# EAGLE design ActuatorController (EAGLE 8.7.1)
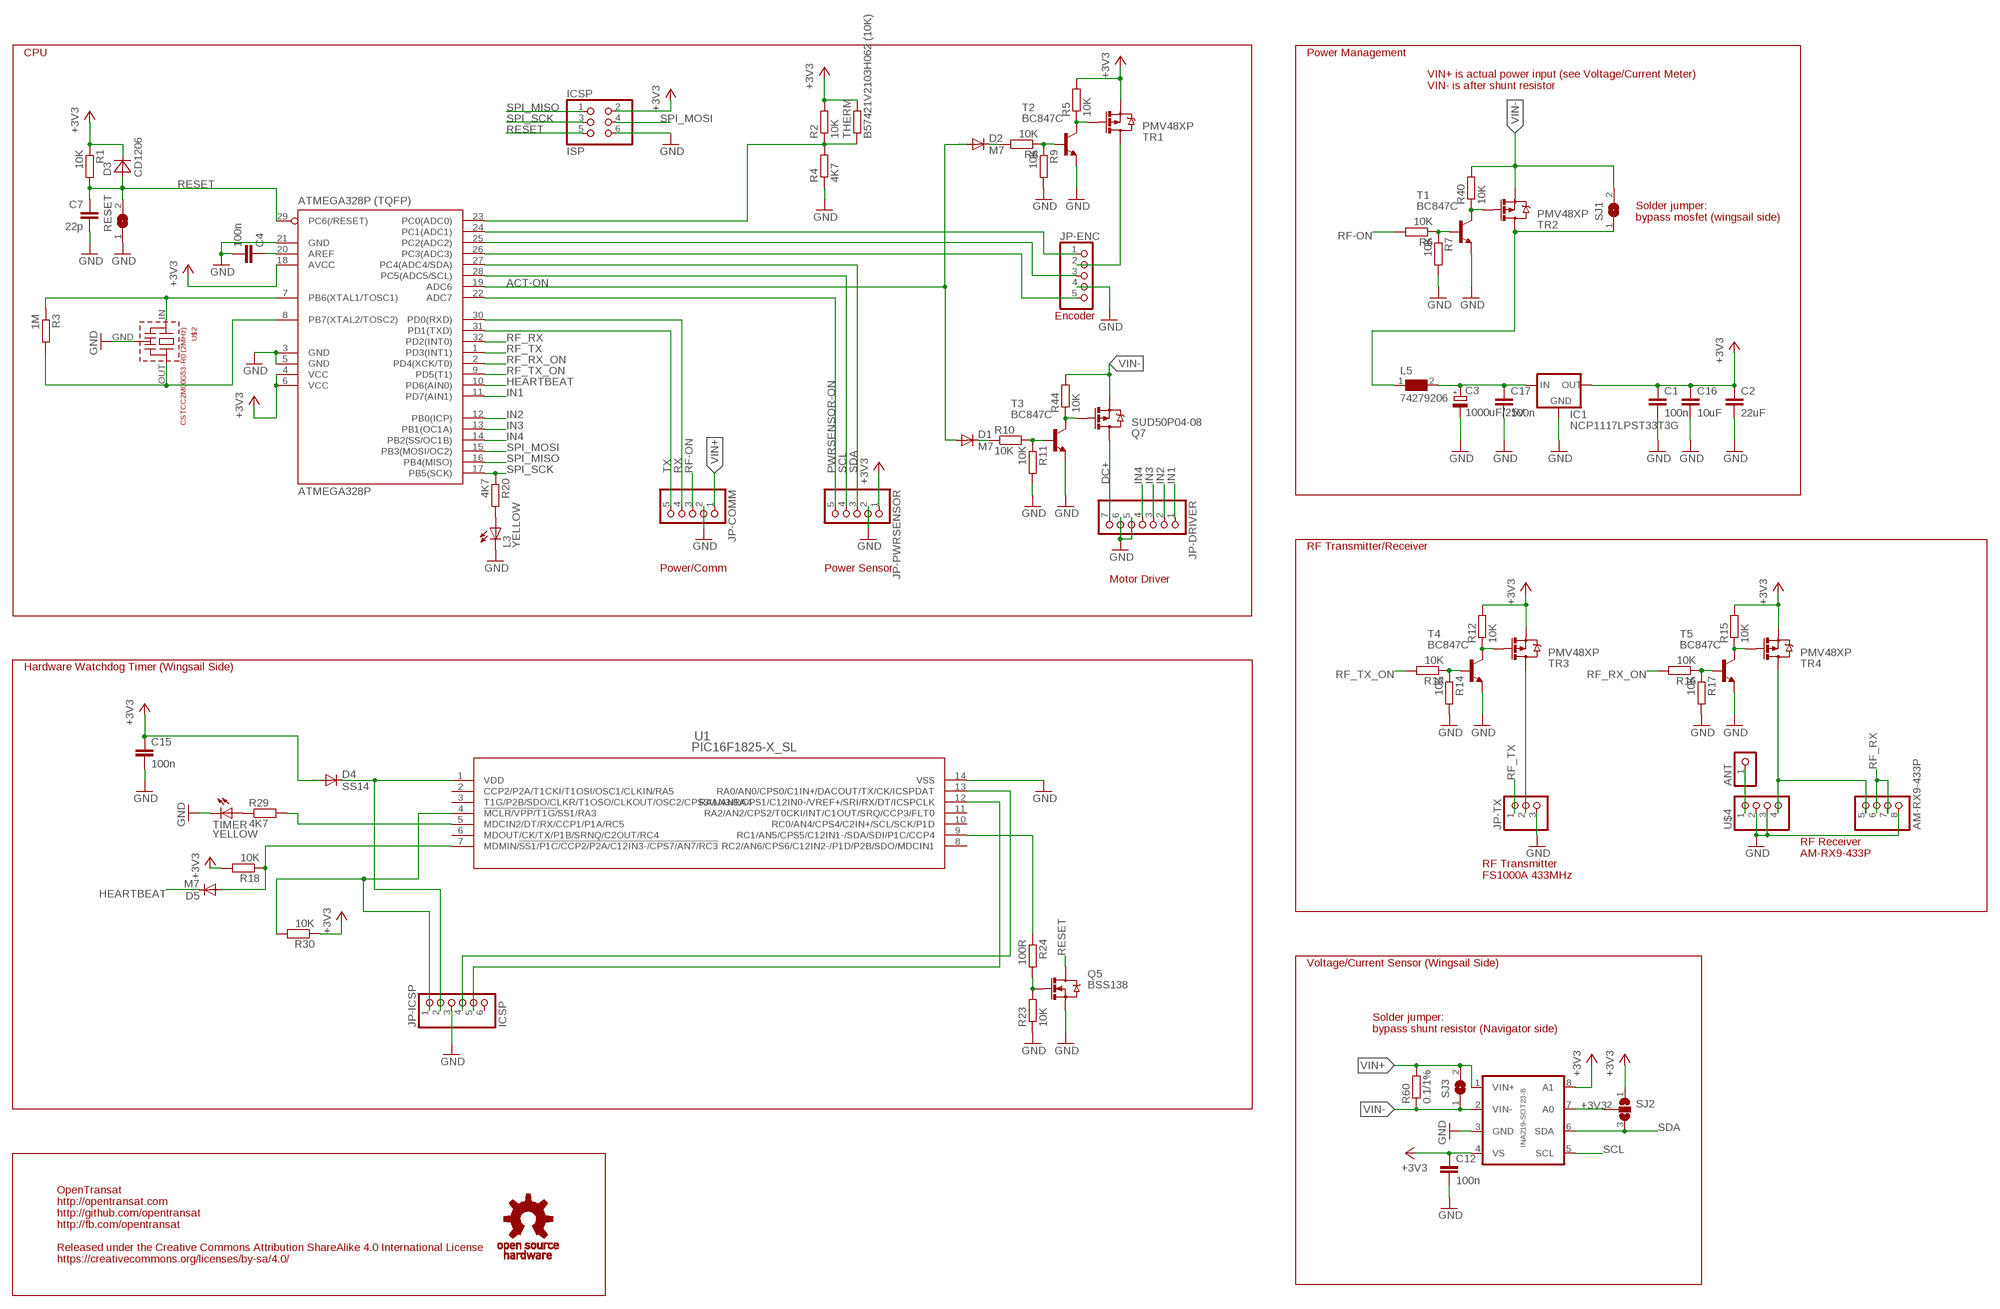
[diagram p0: schematic, sheet 1]

## Parts
ANT  PINHD-1X1  [1X01]
ATMEGA328P  ATMEGA328P (TQFP)  MEGA8-AI  [TQFP32-08]
C1  100n  C-EUC0603  [C0603]
C2  22uF  C-EUC1210  [C1210]
C3  1000uF/25V  CPOL-EUE5-10.5  [E5-10,5]
C4  100n  C-EUC0603  [C0603]
C7  22p  C-EUC0603  [C0603]
C12  100n  C-EUC0603  [C0603]
C15  100n  C-EUC0603  [C0603]
C16  10uF  C-EUC1206  [C1206]
C17  100n  C-EUC0603  [C0603]
D1  M7  DIODE-DO-214AC  [DO-214AC]
D2  M7  DIODE-DO-214AC  [DO-214AC]
D3  CD1206  [R1206]
D4  SS14  DIODE-DO214AC  [DO214AC]
D5  M7  DIODE-DO-214AC  [DO-214AC]
IC1  NCP1117LPST33T3G  LM1117MP-3.3  [SOT223]
ICSP  ISP  PINHD-2X3  [2X03]
JP-COMM  PINHD-1X5/90  [1X05/90]
JP-DRIVER  PINHD-1X7/90  [1X07/90]
JP-ENC  PINHD-1X5/90  [1X05/90]
JP-ICSP  ICSP  PINHD-1X6  [1X06]
JP-PWRSENSOR  PINHD-1X5/90  [1X05/90]
JP-TX  PINHD-1X3  [1X03]
L3  YELLOW  LEDCHIPLED_0805  [CHIPLED_0805]
L5  74279206  WE-CBF_0805  [0805]
Q5  BSS138  MOSFET-NCHANNEL_SOT23-3  [SOT23-3]
Q7  SUD50P04-08  MOSFET-PCHANNEL_D-PAK  [D-PAK_TO252AA]
R1  10K  R-EU_R0603  [R0603]
R2  10K  R-EU_R0603  [R0603]
R3  1M  R-EU_R0603  [R0603]
R4  4K7  R-EU_R0603  [R0603]
R5  10K  R-EU_R0603  [R0603]
R6  10K  R-EU_R0603  [R0603]
R7  10K  R-EU_R0603  [R0603]
R8  10K  R-EU_R0603  [R0603]
R9  10K  R-EU_R0603  [R0603]
R10  10K  R-EU_R0603  [R0603]
R11  10K  R-EU_R0603  [R0603]
R12  10K  R-EU_R0603  [R0603]
R13  10K  R-EU_R0603  [R0603]
R14  10K  R-EU_R0603  [R0603]
R15  10K  R-EU_R0603  [R0603]
R16  10K  R-EU_R0603  [R0603]
R17  10K  R-EU_R0603  [R0603]
R18  10K  R-EU_R0603  [R0603]
R20  4K7  R-EU_R0603  [R0603]
R23  10K  R-EU_R0603  [R0603]
R24  100R  R-EU_R0603  [R0603]
R29  4K7  R-EU_R0603  [R0603]
R30  10K  R-EU_R0603  [R0603]
R40  10K  R-EU_R0603  [R0603]
R44  10K  R-EU_R0603  [R0603]
R60  0.1/1%  R-EU_R2512  [R2512]
RESET  SJW  [SJW]
SJ1  SJ  [SJ]
SJ2  SJ2W  [SJ_2]
SJ3  SJ  [SJ]
T1  BC847C  BC847  [SOT23]
T2  BC847C  BC847  [SOT23]
T3  BC847C  BC847  [SOT23]
T4  BC847C  BC847  [SOT23]
T5  BC847C  BC847  [SOT23]
THERM  B57421V2103H062 (10K)  R-EU_R0603  [R0603]
TIMER  YELLOW  LEDCHIPLED_0805  [CHIPLED_0805]
TR1  PMV48XP  MOSFET-PCHANNEL_SOT23-3  [SOT23-3]
TR2  PMV48XP  MOSFET-PCHANNEL_SOT23-3  [SOT23-3]
TR3  PMV48XP  MOSFET-PCHANNEL_SOT23-3  [SOT23-3]
TR4  PMV48XP  MOSFET-PCHANNEL_SOT23-3  [SOT23-3]
U1  PIC16F1825-X_SL  [SOIC14-N_MC]
U$1  OSHW_S  [OSHWS]
U$2  CSTCC2M00G53-R0 (2MHz)  CSTCC  [CSTCC]
U$3  INA219-SOT23-8  [SOT23-8]
U$4  AM-RX9-433P  [1X04]

## Nets
+3V3: ATMEGA328P.4(VCC) ATMEGA328P.6(VCC) ATMEGA328P.18(AVCC) C1.1 C2.1 C12.1 C15.1 C16.1 D3.2(C) D4.A IC1.2(OUT) IC1.4(OUT) ICSP.2 JP-PWRSENSOR.1 R1.1 R2.2 R5.2 R12.2 R15.2 R18.2 R30.1 SJ2.1 SJ2.2 THERM.2 TR1.2(S) TR3.2(S) TR4.2(S) U$3.4(VS) U$3.7(A0) U$3.8(A1)
ACT-ON: ATMEGA328P.19(ADC6) D1.A D2.A
AREF: ATMEGA328P.20(AREF) C4.1
DC+ [1A]: JP-DRIVER.7 Q7.2(D)
GND [1A]: ATMEGA328P.3(GND) ATMEGA328P.5(GND) ATMEGA328P.21(GND) C1.2 C2.2 C3.- C4.2 C7.2 C12.2 C15.2 C16.2 C17.2 IC1.1(GND) ICSP.6 JP-COMM.2 JP-DRIVER.5 JP-DRIVER.6 JP-ENC.4 JP-ICSP.3 JP-PWRSENSOR.2 JP-TX.3 L3.C Q5.2(S) R4.1 R7.2 R9.2 R11.2 R14.2 R17.2 R23.1 RESET.1 T1.2(E) T2.2(E) T3.2(E) T4.2(E) T5.2(E) TIMER.C U1.14(VSS) U$2.GND U$3.3(GND) U$4.2 U$4.3 U$4.8
HEARTBEAT: ATMEGA328P.10(PD6(AIN0)) D5.C
IN1: ATMEGA328P.11(PD7(AIN1)) JP-DRIVER.1
IN2: ATMEGA328P.12(PB0(ICP)) JP-DRIVER.2
IN3: ATMEGA328P.13(PB1(OC1A)) JP-DRIVER.3
IN4: ATMEGA328P.14(PB2(SS/OC1B)) JP-DRIVER.4
N$1: C3.+ C17.1 IC1.3(IN) L5.2
N$3: R5.1 T2.3(C) TR1.1(G)
N$4: L3.A R20.2
N$5: R10.2 R11.1 T3.1(B)
N$6: ATMEGA328P.23(PC0(ADC0)) R2.1 R4.2 THERM.1
N$7: ATMEGA328P.24(PC1(ADC1)) JP-ENC.1
N$8: ATMEGA328P.25(PC2(ADC2)) JP-ENC.3
N$9: ATMEGA328P.26(PC3(ADC3)) JP-ENC.5
N$11: R8.1 R9.1 T2.1(B)
N$12: R6.1 R7.1 T1.1(B)
N$13: JP-ENC.2 TR1.3(D)
N$14: D2.C R8.2
N$15: D1.C R10.1
N$17: R12.1 T4.3(C) TR3.1(G)
N$19: R13.1 R14.1 T4.1(B)
N$20: ANT.1 U$4.1
N$21: JP-TX.2 TR3.3(D)
N$23: R15.1 T5.3(C) TR4.1(G)
N$24: R16.1 R17.1 T5.1(B)
N$25: TR4.3(D) U$4.4 U$4.5
N$26: D5.A R18.1 U1.7(MDMIN/!SS1/P1C/CCP2/P2A/C12IN3-/CPS7/AN7/RC3)
N$30: JP-ICSP.4 U1.13(RA0/AN0/CPS0/C1IN+/DACOUT/TX/CK/ICSPDAT)
N$32: Q7.1(G) R44.1 T3.3(C)
N$35: R40.1 T1.3(C) TR2.1(G)
N$36: JP-ICSP.1 R30.2 U1.4(!MCLR/VPP/T1G/!SS1/RA3)
N$37: JP-ICSP.5 U1.12(RA1/AN1/CPS1/C12IN0-/VREF+/SRI/RX/DT/ICSPCLK)
N$41: D4.C JP-ICSP.2 U1.1(VDD)
N$42: R24.1 U1.9(RC1/AN5/CPS5/C12IN1-/SDA/SDI/P1C/CCP4)
N$46: Q5.1(G) R23.2 R24.2
N$51: R29.2 U1.5(MDCIN2/DT/RX/CCP1/P1A/RC5)
N$52: R29.1 TIMER.A
PWRSENSOR-ON: ATMEGA328P.22(ADC7) JP-PWRSENSOR.5
RESET: ATMEGA328P.29(PC6(/RESET)) C7.1 D3.1(A) ICSP.5 Q5.3(D) R1.2 RESET.2
RF-ON: JP-COMM.3 R6.2
RF_RX: ATMEGA328P.32(PD2(INT0)) U$4.6 U$4.7
RF_RX_ON: ATMEGA328P.2(PD4(XCK/T0)) R16.2
RF_TX: ATMEGA328P.1(PD3(INT1)) JP-TX.1
RF_TX_ON: ATMEGA328P.9(PD5(T1)) R13.2
RX: ATMEGA328P.30(PD0(RXD)) JP-COMM.4
SCL: ATMEGA328P.28(PC5(ADC5/SCL)) JP-PWRSENSOR.4 U$3.5(SCL)
SDA: ATMEGA328P.27(PC4(ADC4/SDA)) JP-PWRSENSOR.3 SJ2.3 U$3.6(SDA)
SPI_MISO: ATMEGA328P.16(PB4(MISO)) ICSP.1
SPI_MOSI: ATMEGA328P.15(PB3(MOSI/OC2)) ICSP.4
SPI_SCK: ATMEGA328P.17(PB5(SCK)) ICSP.3 R20.1
TX: ATMEGA328P.31(PD1(TXD)) JP-COMM.5
VBAT-ON: L5.1 SJ1.1 TR2.3(D)
VIN+ [1A]: JP-COMM.1 R60.2 SJ3.2 U$3.1(VIN+)
VIN- [1A]: Q7.3(S) R40.2 R44.2 R60.1 SJ1.2 SJ3.1 TR2.2(S) U$3.2(VIN-)
XTAL1: ATMEGA328P.8(PB7(XTAL2/TOSC2)) R3.2 U$2.OUT
XTAL2: ATMEGA328P.7(PB6(XTAL1/TOSC1)) R3.1 U$2.IN
Unconnected: JP-ICSP.6 U1.2(CCP2/P2A/T1CKI/T1OSI/OSC1/CLKIN/RA5) U1.3(T1G/P2B/SDO/CLKR/T1OSO/CLKOUT/OSC2/CPS3/AN3/RA4) U1.6(MDOUT/CK/TX/P1B/SRNQ/C2OUT/RC4) U1.8(RC2/AN6/CPS6/C12IN2-/P1D/P2B/SDO/MDCIN1) U1.10(RC0/AN4/CPS4/C2IN+/SCL/SCK/P1D) U1.11(RA2/AN2/CPS2/T0CKI/INT/C1OUT/SRQ/CCP3/FLT0)

## Notes on the sheet
- CPU | Power Management
- VIN+ is actual power input (see Voltage/Current Meter)
  VIN- is after shunt resistor
- Solder jumper:
  bypass mosfet (wingsail side)
- Encoder
- RF Transmitter/Receiver
- Power/Comm | Power Sensor
- Motor Driver
- Hardware Watchdog Timer (Wingsail Side)
- RF Receiver
  AM-RX9-433P
- RF Transmitter
  FS1000A 433MHz
- Voltage/Current Sensor (Wingsail Side)
- Solder jumper:
  bypass shunt resistor (Navigator side)
- OpenTransat
  http://opentransat.com
  http://github.com/opentransat
  http://fb.com/opentransat
  
  Released under the Creative Commons Attribution ShareAlike 4.0 International License
  https://creativecommons.org/licenses/by-sa/4.0/

## Library data of the parts
ANT = pinhead:PINHD-1X1: PIN HEADER
ATMEGA328P = atmel:MEGA8: MICROCONTROLLER 8 Kbytes FLASH, 1 kbytes SRAM, 512 bytes EEPROM, USART, 6-channel 10 bit ADC, 2-channel 8 bit ADC Pin compatible with Atmega48, ATMega88, ATMega168 Source: avr.lbr; MPN: ATMEGA8-16AU; OC_FARNELL: 9171371; OC_NEWARK: 73M8863
C1 C2 C4 C7 C12 C15-C17 = rcl:C-EU: CAPACITOR, European symbol; SPICEPREFIX: C
C3 = transducer:CPOL-EU: POLARIZED CAPACITOR, European symbol
D1 D2 D4 D5 = diode:DIODE-: DIODE
D3 = diodes_smd:CD1206
IC1 = lm1117_10:LM1117?-*: 800mA Low-Dropout Linear Regulator Source: http://www.ti.com/lit/ds/symlink/lm1117-n.pdf; MF: Texas Instruments; MPN: LM1117MP-3.3; OC_FARNELL: 9778195; OC_NEWARK: 28X3416
ICSP = pinhead:PINHD-2X3: PIN HEADER
JP-COMM JP-ENC JP-PWRSENSOR = pinhead:PINHD-1X5: PIN HEADER
JP-DRIVER = pinhead:PINHD-1X7: PIN HEADER
JP-ICSP = pinhead:PINHD-1X6: PIN HEADER
JP-TX = pinhead:PINHD-1X3: PIN HEADER
L3 TIMER = led:LED: LED OSRAM: - CHIPLED LG R971, LG N971, LY N971, LG Q971, LY Q971, LO R971, LY R971 LH N974, LH R974 LS Q976, LO Q976, LY Q976 LO Q996 - Hyper CHIPLED LW Q18S LB Q993, LB Q99A, LB R99A - SideLED LS A670, LO A670, LY A670, LG A670, LP A670 LB A673, LV A673, LT A673, LW A673 LH A674 LY A675 LS A676, LA A676, LO A676, LY A676, LW A676 LS A679, LY A679, LG A679 - Hyper Micro SIDELED® LS Y876, LA Y876, LO Y876, LY Y876 LT Y87S - SmartLED LW L88C, LW L88S LB L89C, LB L89S, LG L890 LS L89K, LO L89K, LY L89K LS L896, LA L896, LO L896, LY L896 - TOPLED LS T670, LO T670, LY T670, LG T670, LP T670 LSG T670, LSP T670, LSY T670, LOP T670, LYG T670 LG T671, LOG T671, LSG T671 LB T673, LV T673, LT T673, LW T673 LH T674 LS T676, LA T676, LO T676, LY T676, LB T676, LH T676, LSB T676, LW T676 LB T67C, LV T67C, LT T67C, LS T67K, LO T67K, LY T67K, LW E67C LS E67B, LA E67B, LO E67B, LY E67B, LB E67C, LV E67C, LT E67C LW T67C LS T679, LY T679, LG T679 LS T770, LO T770, LY T770, LG T770, LP T770 LB T773, LV T773, LT T773, LW T773 LH T774 LS E675, LA E675, LY E675, LS T675 LS T776, LA T776, LO T776, LY T776, LB T776 LHGB T686 LT T68C, LB T68C - Hyper Mini TOPLED® LB M676 - Mini TOPLED Santana® LG M470 LS M47K, LO M47K, LY M47K Source: http://www.osram.convergy.de LUXEON: - LUMILED® LXK2-PW12-R00, LXK2-PW12-S00, LXK2-PW14-U00, LXK2-PW14-V00 LXK2-PM12-R00, LXK2-PM12-S00, LXK2-PM14-U00 LXK2-PE12-Q00, LXK2-PE12-R00, LXK2-PE12-S00, LXK2-PE14-T00, LXK2-PE14-U00 LXK2-PB12-K00, LXK2-PB12-L00, LXK2-PB12-M00, LXK2-PB14-N00, LXK2-PB14-P00, LXK2-PB14-Q00 LXK2-PR12-L00, LXK2-PR12-M00, LXK2-PR14-Q00, LXK2-PR14-R00 LXK2-PD12-Q00, LXK2-PD12-R00, LXK2-PD12-S00 LXK2-PH12-R00, LXK2-PH12-S00 LXK2-PL12-P00, LXK2-PL12-Q00, LXK2-PL12-R00 Source: www.luxeon.com KINGBRIGHT: KA-3528ASYC Source: www.kingbright.com
L5 = Wurth_Elektronik_Passive_rev15b:WE-CBF: SMD EMI Suppression Ferrite Beads WE-CBF - Excellent anti-EMI properties - Low DC-restistance - Impedances till 3000 ohms - Rated current up to 6 A -- Reliable Ni-Sn electrodes -- Perfect as data lined filter and for uncoupling of distribution voltage <http://katalog.we-online.de/media/images/eisos/FeCBF_pf2.jpg> Details see: http://katalog.we-online.de/en/pbs/WE-CBF updated by Dan Xu 2014-06-19 2014 (C) Würth Elektronik
Q5 = Simplex-DiscreteSemi:MOSFET-NCHANNEL: Generic N-channel mosfet
Q7 TR1-TR4 = Simplex-DiscreteSemi:MOSFET-PCHANNEL: Generic P-channel mosfet
R1-R18 R20 R23 R24 R29 R30 R40 R44 R60 THERM = rcl:R-EU_: RESISTOR, European symbol; SPICEPREFIX: R
RESET SJ1 SJ3 = jumper:SJ: SMD solder JUMPER
SJ2 = jumper:SJ2W: SMD solder JUMPER
T1-T5 = transistor:BC847: NPN TRANSISTOR
U1 = PIC16F1825:PIC16F1825-X_SL
U$1 = oshw:OSHW_S
U$2 = murata-cstcc-cstcv-resonators:CSTCC: Murata CSTCC Resonator - 7,2 x 3,0 mm
U$3 = INA219:INA219-SOT23-8: INA219 Bi-Directional CURRENT/POWER MONITOR with I2C™ Interface http://www.ti.com/lit/ds/symlink/ina219.pdf
U$4 = AM-RX9:AM-RX9-433P

## Net classes
4 1A: width 0.305 mm, drill 0.305 mm, clearance 0.305 mm

## Board
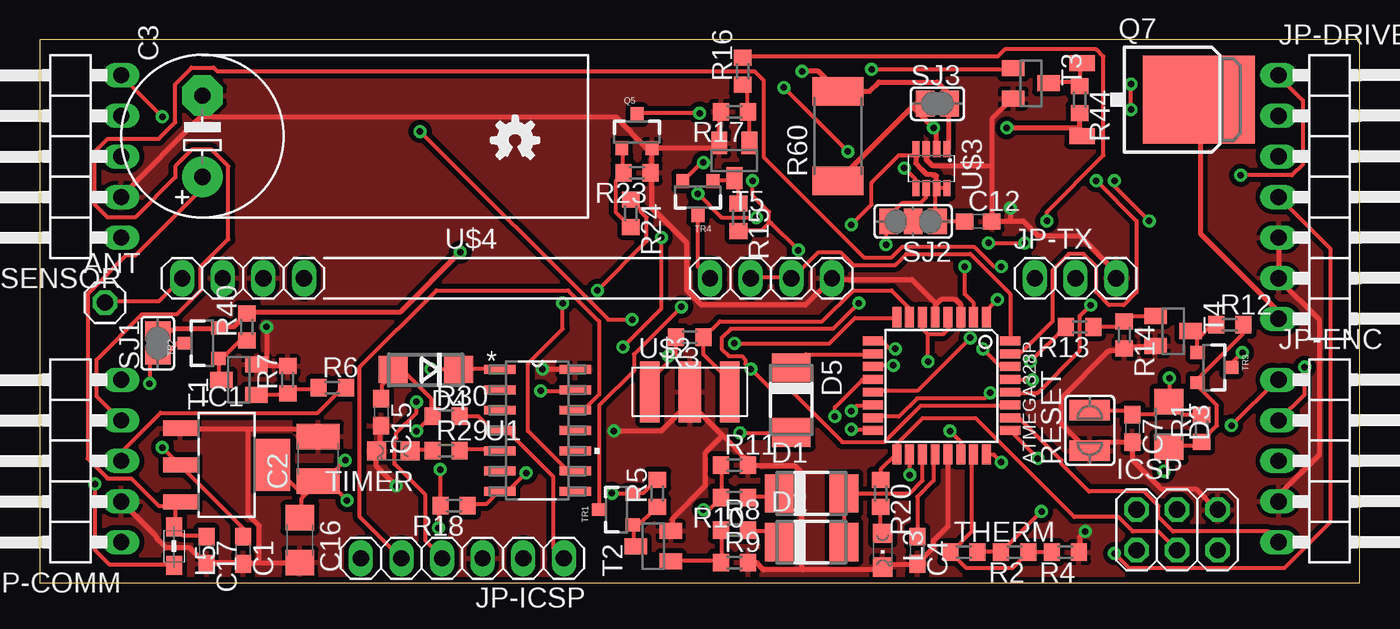
[diagram p1: board, top side]
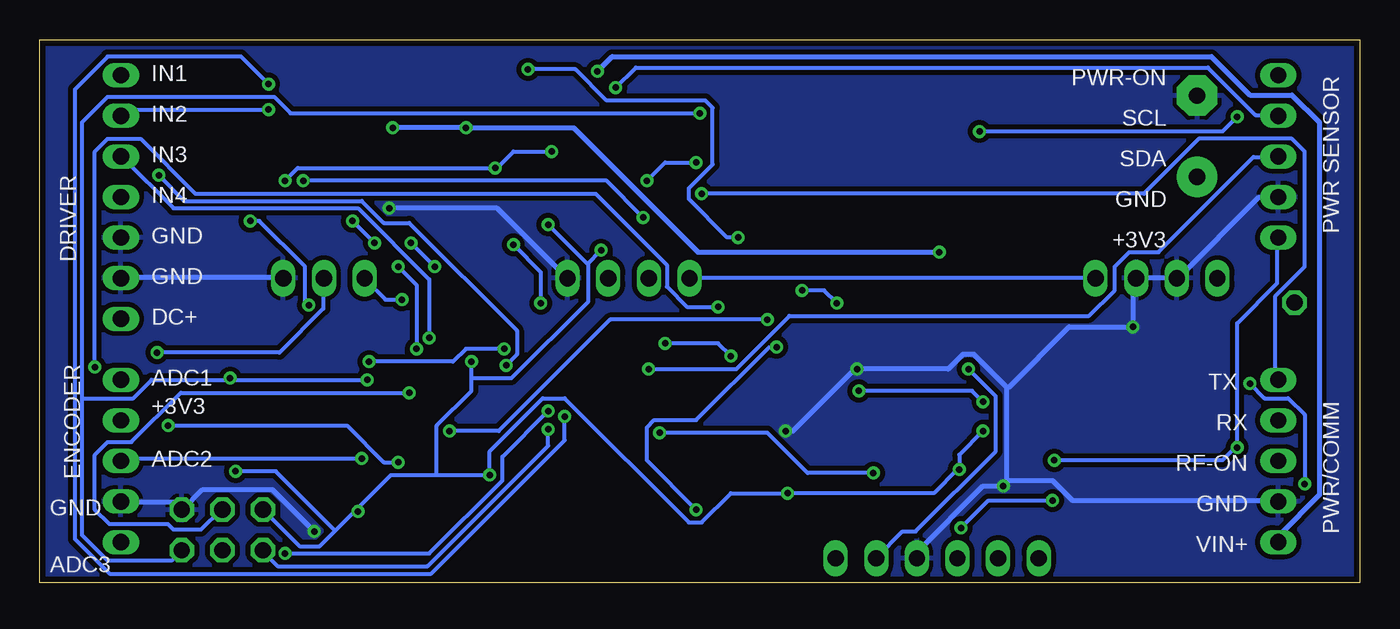
[diagram p2: board, bottom side, seen from below]

Size 82.53 x 33.96 mm. Coordinates in mm from the lower left corner, seen from the top.
Outline: 0,0 82.53,0 82.53,33.96 0,33.96 0,0
Copper layers (1*16): Top 0.035mm / dielectric 1.5mm / Bottom 0.035mm
Design rules "autorouter": minimum track width 10mil, minimum drill 16mil, track to track 8mil, track to pad 8mil, pad to pad 8mil, via to via 8mil, smd to smd 8mil, copper to edge 15mil, drill to drill 12mil, minimum pad ring 10mil, minimum via ring 8mil, stop-mask expansion 1mil, vias tented up to drill 30mil, thermal gap 10mil

### Footprints (pad centres in the part's own frame; a part is rotated, then mirrored left to right if it is on the bottom)
1X01 = drill 1.016 octagon: 1 0,0
TQFP32-08 = smd 1.27 x 0.559: 1 -4.293,2.8; 2 -4.293,2; 3 -4.293,1.2; 4 -4.293,0.4; 5 -4.293,-0.4; 6 -4.293,-1.2; 7 -4.293,-2; 8 -4.293,-2.8; 17 4.293,-2.8; 18 4.293,-2; 19 4.293,-1.2; 20 4.293,-0.4; 21 4.293,0.4; 22 4.293,1.2; 23 4.293,2; 24 4.293,2.8 | smd 0.559 x 1.27: 9 -2.8,-4.293; 10 -2,-4.293; 11 -1.2,-4.293; 12 -0.4,-4.293; 13 0.4,-4.293; 14 1.2,-4.293; 15 2,-4.293; 16 2.8,-4.293; 25 2.8,4.293; 26 2,4.293; 27 1.2,4.293; 28 0.4,4.293; 29 -0.4,4.293; 30 -1.2,4.293; 31 -2,4.293; 32 -2.8,4.293
C0603 = smd 1.1 x 1: 1 -0.85,0; 2 0.85,0
C1210 = smd 1.6 x 2.7: 1 -1.4,0; 2 1.4,0
E5-10,5 = drill 1.016 pad 2.54: + -2.54,0 | drill 1.016 pad 2.54 octagon: - 2.54,0
C1206 = smd 1.6 x 1.8: 1 -1.4,0; 2 1.4,0
DO-214AC = smd 1.8 x 2.4: A 2.025,0; C -2.025,0
R1206 = smd 1.6 x 1.803: 1 -1.422,0; 2 1.422,0
DO214AC = smd 1.8 x 1.7: A 2.05,0; C -2.05,0
SOT223 = smd 0.95 x 2.15: 1 -2.3,-2.9; 2 0,-2.9; 3 2.3,-2.9 | smd 3.25 x 2.15: 4 0,2.9
2X03 = drill 1.016 octagon: 1 -2.54,-1.27; 2 -2.54,1.27; 3 0,-1.27; 4 0,1.27; 5 2.54,-1.27; 6 2.54,1.27
1X05/90 = drill 1.016 long: 1 -5.08,-3.81; 2 -2.54,-3.81; 3 0,-3.81; 4 2.54,-3.81; 5 5.08,-3.81
1X07/90 = drill 1.016 long: 1 -7.62,-3.81; 2 -5.08,-3.81; 3 -2.54,-3.81; 4 0,-3.81; 5 2.54,-3.81; 6 5.08,-3.81; 7 7.62,-3.81
1X06 = drill 1.016 long: 1 -6.35,0; 2 -3.81,0; 3 -1.27,0; 4 1.27,0; 5 3.81,0; 6 6.35,0
1X03 = drill 1.016 long: 1 -2.54,0; 2 0,0; 3 2.54,0
CHIPLED_0805 = smd 1.2 x 1.2: A 0,-1.05; C 0,1.05
0805 = smd 1.2 x 1: 1 -1.2,0; 2 1.2,0
SOT23-3 = smd 0.8 x 0.9: 1 -0.95,-1; 2 0.95,-1; 3 0,1.1
D-PAK_TO252AA = smd 1 x 1.6: 1 -2.28,-4.8; 3 2.28,-4.8 | smd 5.5 x 7: 2 0,2.5
R0603 = smd 1 x 1.1: 1 -0.85,0; 2 0.85,0
R2512 = smd 1.8 x 3.2: 1 -2.8,0; 2 2.8,0
SJW = smd 1.27 x 2.54: 1 -1.27,0; 2 1.27,0
SJ = smd 1.168 x 1.6: 1 -0.762,0; 2 0.762,0
SJ_2 = smd 1.168 x 1.6: 1 -1.524,0; 2 0,0; 3 1.524,0
SOT23 = smd 1 x 1.4: 1 -0.95,-1.1; 2 0.95,-1.1; 3 0,1.1
SOIC14-N_MC = smd 1.981 x 0.559: 1 -2.362,3.81; 2 -2.362,2.54; 3 -2.362,1.27; 4 -2.362,0; 5 -2.362,-1.27; 6 -2.362,-2.54; 7 -2.362,-3.81; 8 2.362,-3.81; 9 2.362,-2.54; 10 2.362,-1.27; 11 2.362,0; 12 2.362,1.27; 13 2.362,2.54; 14 2.362,3.81
CSTCC = smd 1.4 x 3.8: GND 0,0 | smd 1.2 x 3.8: IN 2.5,0; OUT -2.5,0
SOT23-8 = smd 1 x 0.45: 1 -1.225,0.975; 2 -1.225,0.325; 3 -1.225,-0.325; 4 -1.225,-0.975; 5 1.225,-0.975; 6 1.225,-0.325; 7 1.225,0.325; 8 1.225,0.975
1X04 = drill 1.016 long: 1 -3.81,0; 2 -1.27,0; 3 1.27,0; 4 3.81,0; 5 29.21,0; 6 31.75,0; 7 34.29,0; 8 36.83,0

### Placement (x,y rotation side)
ANT  4.06,17.53 0 top
ATMEGA328P  56.39,12.32 270 top
C1  12.7,2.03 270 top
C2  17.4,7.75 90 top
C3  10.16,27.94 90 top
C4  54.86,2.03 270 top
C7  68.33,9.65 270 top
C12  58.67,22.61 0 top
C15  21.34,10.67 270 top
C16  16.26,2.67 270 top
C17  10.41,2.03 270 top
D1  48.26,5.59 0 top
D2  48.26,2.54 0 top
D3  70.61,9.91 270 top
D4  24.13,13.34 180 top
D5  46.99,11.43 270 top
IC1  11.68,7.37 270 top
ICSP  71.12,3.3 0 top
JP-COMM  1.27,7.62 90 top
JP-DRIVER  81.28,24.13 270 top
JP-ENC  81.28,7.62 270 top
JP-ICSP  26.42,1.52 180 top
JP-PWRSENSOR  1.27,26.67 90 top
JP-TX  64.77,19.05 0 top
L3  52.7,2.03 180 top
L5  8.38,2.29 90 top
Q5  37.34,28.19 0 top
Q7  69.98,30.23 270 top
R1  72.64,9.65 90 top
R2  60.96,1.91 180 top
R3  40.64,15.37 180 top
R4  64.14,1.91 180 top
R5  38.61,5.59 90 top
R6  18.29,12.19 0 top
R7  15.49,12.7 90 top
R8  43.43,3.3 0 top
R9  43.43,1.27 0 top
R10  43.43,5.33 180 top
R11  43.43,7.37 0 top
R12  74.42,16.13 0 top
R13  65.02,16 180 top
R14  67.82,15.49 270 top
R15  43.69,22.86 270 top
R16  43.94,32 90 top
R17  43.43,29.46 180 top
R18  25.91,4.83 180 top
R20  52.58,5.59 270 top
R23  37.34,25.65 180 top
R24  36.96,23.11 270 top
R29  25.4,8.26 0 top
R30  25.4,10.41 0 top
R40  12.95,16 90 top
R44  65.02,30.23 270 top
R60  49.91,27.94 90 top
RESET  65.66,9.53 90 top
SJ1  7.37,14.99 90 top
SJ2  54.61,22.61 180 top
SJ3  56.13,29.97 0 top
T1  12.45,12.7 90 top
T2  38.35,2.29 90 top
T3  61.98,31.24 270 top
T4  70.87,15.75 270 top
T5  43.43,26.42 180 top
THERM  57.78,1.91 0 top
TIMER  22.1,8.26 90 top
TR1  36.07,4.57 90 top
TR2  10.16,14.99 90 top
TR3  73.41,13.46 270 top
TR4  41.15,24.13 180 top
U1  31.11,9.53 0 top
U$1  29.72,27.69 0 top
U$2  40.64,11.94 0 top
U$3  55.75,25.91 270 top
U$4  12.7,19.05 0 top

### Tracks (layer width: path | path; a pad name or v marks a point on that pad's centre or on a via)
+3V3  (via drill 0.41)
  Top 0.254: 16.52,5.43 17.37,6.29 C2.1 | 16.52,5.43 16.34,5.26 16.34,4.12 C16.1 | 16.52,5.43 14.63,7.32 IC1.4 | C1.1 12.69,2.97 12.69,3.43 8.8,7.32 IC1.2 8.69,7.43 v7.66,8.46 | v19.09,7.66 17.83,6.4 17.49,6.4 C2.1 | R5.2 38.52,6.4 37.72,5.6 37.15,5.6 TR1.2 37.03,5.6 v35.78,5.6 | v25.03,7.09 25.03,4.92 R18.2 24.92,4.92 v24.92,3.43 | v23.55,9.49 24.46,10.4 R30.1 24.46,10.52 24.46,11.54 22.75,13.26 22.17,13.26 D4.A 22.17,13.14 21.37,12.34 21.37,11.54 C15.1 | R12.2 75.21,16.12 75.21,15.54 72.47,12.8 72.47,12.57 TR3.2 72.47,12.46 72.47,12.23 73.61,11.09 73.61,9.83 72.69,8.91 R1.1 72.58,8.8 72.35,8.57 70.64,8.57 D3.2 70.52,8.46 70.52,7.2 v70.29,6.97 | v41.49,26.29 41.38,26.29 40.23,25.15 TR4.2 | v44.58,25.15 44.58,24.23 45.61,23.2 45.61,22.52 | 45.61,22.52 45.15,22.06 43.78,22.06 R15.2 | U$3.8 56.69,24.69 56.12,24.69 U$3.7 56.01,24.57 56.01,22.75 SJ2.1 | C12.1 57.72,22.63 56.24,22.63 SJ2.1 | SJ2.2 54.63,22.63 56.01,22.63 SJ2.1 | 55.55,15.54 55.21,15.89 55.21,16.57 ATMEGA328P.6 | 55.55,15.54 56.46,15.54 56.81,15.89 56.81,16.57 ATMEGA328P.4 | THERM.2 58.64,1.94 60.01,1.94 R2.2 60.12,1.94 v62.64,4.46 | v54.41,6.74 54.41,8 ATMEGA328P.18 | v55.55,13.83 55.55,15.54 | v50.75,22.4 52.01,23.66 52.01,25.03 53.72,26.75 54.63,26.75 U$3.4 | v47.43,20.8 45.72,22.52 45.61,22.52 | v19.2,5.14 17.95,6.4 C2.1
  Top 0.305: U$3.4 54.78,26.25 55.17,25.83 55.46,25.54 55.8,25.54 55.84,25.5 56.03,25.5 56.08,25.46 U$3.7
  Bottom 0.254: JP-PWRSENSOR.1 5.14,21.49 5.14,18.75 7.66,16.23 v7.66,8.46 7.77,8.46 8.57,7.66 v19.09,7.66 | v23.55,9.49 25.03,8 v25.03,7.09 25.15,7.09 26.63,5.6 v35.78,5.6 39.32,5.6 41.15,3.77 41.95,3.77 49.72,11.54 51.09,11.54 54.41,8.23 v54.41,6.74 57.72,6.74 | v41.49,26.29 43.43,26.29 v44.58,25.15 | 57.72,6.74 60.58,6.74 62.69,4.63 | 64.06,3.26 65.04,2.29 66.29,2.29 ICSP.2 | 64.06,3.26 62.69,4.63 | v62.64,4.46 62.64,4.57 62.69,4.63 | 55.55,12.8 55.55,12 57.72,9.83 57.72,6.74 | 55.55,12.8 v55.55,13.83 | 48.29,19.95 48.23,19.89 48.23,17.6 53.03,12.8 55.55,12.8 | 48.29,19.95 v50.75,22.4 | 48.29,19.95 v47.43,20.8 | v70.29,6.97 67.78,6.97 64.06,3.26 | v19.2,5.14 23.2,5.14 v24.92,3.43
ACT-ON
  Top 0.254: ATMEGA328P.19 55.21,8 55.21,6.4 54.41,5.6 50.29,5.6 D1.A 50.29,5.49 50.29,2.63 D2.A
AREF
  Top 0.254: C4.1 54.86,5.37 55.89,6.4 55.89,8 ATMEGA328P.20
DC+
  Top 0.305: JP-DRIVER.7 77.38,16.57 77.38,17.03 72.58,21.83 72.58,30.18 Q7.2
GND  (via drill 0.41)
  Top 0.305: T4.2 69.72,14.74 67.89,14.74 R14.2 67.78,14.52 66.86,14.52 63.89,11.54 63.89,9.94 65.61,8.23 RESET.1 65.72,8.34 66.18,8.8 68.24,8.8 C7.2 68.35,8.69 68.35,7.66 70.18,5.83 72.35,5.83 73.61,4.57 ICSP.6 | v65.38,3.2 65.04,2.86 65.04,1.94 R4.1 | JP-DRIVER.5 77.5,21.49 77.5,19.09 JP-DRIVER.6 77.5,18.97 80.01,16.46 80.01,8 77.5,5.49 77.5,5.14 JP-ENC.4 | 59.52,26.11 59.55,29.03 60.81,30.29 T3.2 | 59.52,26.11 59.55,22.63 C12.2 59.66,22.63 60.69,22.63 | 60.69,22.63 61.49,22.63 62.41,21.72 65.04,21.72 67.21,19.55 67.21,19.09 JP-TX.3 | Q5.2 38.29,27.09 38.29,25.72 R23.1 38.29,25.6 38.29,23.43 40.46,21.26 40.46,18.29 41.38,17.37 47.89,17.37 49.49,18.97 U$4.8 49.61,18.97 54.52,18.97 56.01,17.49 56.01,17.37 | R17.2 42.52,29.38 42.52,27.55 T5.2 42.41,27.43 42.18,27.2 38.41,27.2 Q5.2 | 56.01,17.37 56.01,16.69 ATMEGA328P.5 | 56.01,17.37 56.35,17.72 57.26,17.72 57.61,17.37 57.61,16.69 ATMEGA328P.3 | R7.2 15.43,13.6 13.6,13.6 T1.2 14.17,13.72 v14.17,16 | 10.06,29.15 10.06,30.4 C3.- | 10.06,29.15 5.14,24.23 JP-PWRSENSOR.2 | 42.69,9.2 40.69,11.2 40.69,11.89 U$2.GND 40.58,11.2 38.86,9.49 v35.89,9.49 | 42.69,9.2 44.23,7.66 44.23,7.43 R11.2 44.35,7.32 47.21,7.32 47.66,6.86 47.66,0.8 | 42.69,9.2 41.6,8.12 41.6,6.06 39.55,4 39.55,3.31 T2.2 | 47.66,0.8 52.58,0.8 52.69,0.91 L3.C 52.81,1.03 52.92,1.14 54.86,1.14 C4.2 54.98,1.26 55.89,2.17 55.89,2.63 56.81,3.54 56.81,8 ATMEGA328P.21 | 47.66,0.8 45.26,0.8 44.81,1.26 44.35,1.26 R9.2 | 13.03,9.6 17.03,9.6 17.37,9.26 C2.2 | 13.03,9.6 8.8,9.6 IC1.1 | 13.72,1.26 12.8,1.26 C1.2 12.69,1.26 10.52,1.26 C17.2 10.29,1.26 9.37,2.17 7.89,2.17 7.32,2.74 7.32,2.86 5.14,5.03 JP-COMM.2
  Top 0.305: 13.72,1.26 16.23,1.26 C16.2 | 13.03,9.6 13.03,4.23 13.72,3.54 13.72,1.26 | C15.2 21.26,9.72 21.26,8.46 21.14,8.34 TIMER.C 21.03,8.12 21.03,7.32 v22.29,6.06 | v31.43,13.37 33.38,13.37 U1.14 | 10.06,29.15 36.01,29.15 37.95,27.2 38.18,27.2 Q5.2 | v60.69,23.43 60.69,22.63 | U$3.3 55.43,26.49 55.8,26.11 59.52,26.11
  Bottom 0.305: v65.38,3.2 68.01,5.83 72.35,5.83 73.61,4.57 ICSP.6 73.72,4.69 74.07,5.03 77.38,5.03 JP-ENC.4 | JP-DRIVER.6 77.38,19.09 67.32,19.09 JP-TX.3 | JP-PWRSENSOR.2 5.14,24.12 6.29,24.12 11.32,19.09 U$4.2 11.43,19.09 13.83,19.09 U$4.3 14.06,18.97 14.17,18.86 v14.17,16 18.17,16 21.95,12.23 22.06,12.23 | JP-ICSP.3 27.66,1.6 27.66,1.94 23.55,6.06 v22.29,6.06 22.29,6.17 22.06,6.4 | 22.06,12.23 24.12,14.29 24.8,14.29 25.72,13.37 v31.43,13.37 31.55,13.37 35.43,9.49 v35.89,9.49 | 22.06,6.4 22.06,12.23 | 22.06,6.4 19.2,6.4 17.95,5.14 5.14,5.14 JP-COMM.2 | v60.69,23.43 53.95,23.43 49.61,19.09 U$4.8
  pour Top: -10.16,-2.54 90.17,-2.54 90.17,36.83 -10.16,36.83
  pour Bottom: -11.43,-5.08 92.71,-5.08 92.71,39.37 -11.43,39.37
HEARTBEAT
  Top 0.254: ATMEGA328P.10 52.01,14.29 47.89,14.29 47.09,13.49 D5.C
IN1  (via drill 0.41)
  Top 0.254: v53.38,13.6 52.12,13.6 ATMEGA328P.11 | v75.09,25.49 78.3,25.49 78.98,26.18 78.98,30.18 77.5,31.66 JP-DRIVER.1
  Bottom 0.254: v53.38,13.6 52.69,14.29 52.69,15.77 59.44,22.52 61.04,22.52 62.41,23.89 73.5,23.89 v75.09,25.49
IN2  (via drill 0.41)
  Top 0.254: v49.72,10.4 49.72,10.97 51.44,12.69 52.01,12.69 ATMEGA328P.12 | v68.24,29.6 v68.24,31.2
  Bottom 0.254: v49.72,10.4 49.72,8.91 58.06,0.57 78.18,0.57 80.35,2.74 80.35,30.86 78.3,32.92 69.95,32.92 v68.24,31.2 | v68.24,29.6 77.04,29.6 77.38,29.26 JP-DRIVER.2
IN3  (via drill 0.41)
  Top 0.254: v58.18,15.32 54.86,12 52.12,12 ATMEGA328P.13
  Bottom 0.254: v58.18,15.32 58.18,18.97 62.64,23.43 74.18,23.43 77.38,26.63 JP-DRIVER.3
IN4  (via drill 0.41)
  Top 0.254: v50.75,10.74 51.09,11.09 52.01,11.09 ATMEGA328P.14 | v67.21,1.83 68.12,0.91 77.84,0.91 80.7,3.77 80.7,20.92 77.5,24.12 JP-DRIVER.4
  Bottom 0.254: v50.75,10.74 53.61,7.89 53.61,6.4 58.18,1.83 v67.21,1.83
N$1
  Top 0.254: C17.1 10.4,2.97 8.91,2.97 8.46,3.43 L5.2 8.46,3.54 8.46,4.8 8.69,5.03 IC1.3 8.34,4.8 7.43,4.8 5.71,6.51 4.23,6.51 2.97,7.77 2.97,18.06 5.37,20.46 5.94,20.46 10.06,24.57 10.06,25.38 C3.+
N$3
  Top 0.254: T2.3 37.15,2.29 37.15,3.54 TR1.1 37.26,3.43 38.52,4.69 R5.1
N$4
  Top 0.254: R20.2 52.58,3.2 L3.A
N$5  (via drill 0.41)
  Top 0.254: R11.1 42.63,7.32 42.63,5.37 R10.2 42.52,5.26 41.83,4.57 v41.49,4.57 | v52.01,32.12 60.81,32.12 T3.1 | v38.86,21.6 38.86,17.14 v36.46,14.74
  Bottom 0.254: v52.01,32.12 49.03,32.12 47.09,30.18 40.92,30.18 40.46,29.72 40.46,26.18 41.95,24.69 41.95,24 39.55,21.6 v38.86,21.6 | v36.46,14.74 36.92,14.74 41.49,10.17 44.12,10.17 44.58,9.72 44.58,7.66 v41.49,4.57
N$6
  Top 0.254: R4.2 63.21,1.94 61.84,1.94 R2.1 61.72,1.83 60.81,0.91 57.95,0.91 57.04,1.83 THERM.1 57.04,1.94 58.29,3.2 58.29,8 ATMEGA328P.23
N$7  (via drill 0.41)
  Top 0.254: v60.12,7.54 59.66,8 59.21,8 ATMEGA328P.24 | v74.52,9.83 77.38,12.69 JP-ENC.1
  Bottom 0.254: v60.12,7.54 61.04,7.54 63.32,9.83 v74.52,9.83
N$8  (via drill 0.41)
  Top 0.254: v62.41,7.77 60.69,9.49 ATMEGA328P.25
  Bottom 0.254: v62.41,7.77 77.27,7.77 77.38,7.66 JP-ENC.3
N$9
  Top 0.254: JP-ENC.5 76.81,3.2 70.87,3.2 69.95,4.12 69.95,4.8 69.04,5.71 65.61,5.71 63.89,7.43 63.89,7.66 61.27,10.29 60.69,10.29 ATMEGA328P.26
N$11
  Top 0.254: R8.1 42.63,3.2 42.63,1.37 R9.1 42.52,1.37 39.55,1.37 T2.1
N$12
  Top 0.254: T1.1 13.6,11.77 15.43,11.77 R7.1 15.54,11.89 15.77,12.12 17.37,12.12 R6.1
N$13  (via drill 0.41)
  Top 0.254: v40.12,17.26 37.15,14.29 37.15,13.26 34.98,11.09 TR1.3 | v79.1,13.49 79.1,11.77 77.5,10.17 JP-ENC.2
  Bottom 0.254: v40.12,17.26 42.06,17.26 43.32,18.52 43.32,19.89 47.78,24.35 72.81,24.35 76.24,27.77 78.3,27.77 79.1,26.98 v79.1,13.49
N$14
  Top 0.254: R8.2 44.35,3.2 45.61,3.2 46.18,2.63 D2.C
N$15
  Top 0.254: R10.1 44.35,5.37 46.06,5.37 46.18,5.49 D1.C
N$17
  Top 0.254: TR3.1 72.35,14.52 72.35,15.32 72.01,15.66 T4.3 72.47,15.32 73.27,16.12 73.5,16.12 R12.1
N$19
  Top 0.254: R13.1 67.55,16 67.78,16.23 R14.1 67.89,16.34 68.24,16.69 69.72,16.69 T4.1
N$20
  Top 0.254: ANT.1 4.12,17.6 7.43,17.6 8.8,18.97 U$4.1
N$21  (via drill 0.41)
  Top 0.254: v75.21,14.4 74.52,13.72 74.52,13.49 TR3.3
  Bottom 0.254: v75.21,14.4 67.55,14.4 64.81,17.14 64.81,18.97 JP-TX.2
N$23
  Top 0.254: TR4.1 42.18,25.15 43.32,25.15 43.43,25.26 T5.3 43.32,25.03 43.66,24.69 43.66,23.77 R15.1
N$24
  Top 0.254: R16.1 44.01,31.09 44.23,30.86 44.23,29.49 R17.1 44.35,29.38 44.35,27.55 T5.1
N$25
  Top 0.254: TR4.3 41.15,19.77 41.83,19.09 U$4.5
  Bottom 0.254: U$4.4 16.57,19.09 41.83,19.09 U$4.5
N$26  (via drill 0.41)
  Top 0.254: R18.1 26.86,4.92 27.89,4.92 28.69,5.71 U1.7 28.8,5.83 29.38,5.83 v30.4,6.86 | v43.78,9.37 46.98,9.37 D5.A
  Bottom 0.254: v43.78,9.37 37.03,9.37 34.52,6.86 v30.4,6.86
N$30  (via drill 0.41)
  Top 0.254: v31.32,12 33.38,12 U1.13 | v23.55,11.32 23.55,10.63 22.29,9.37 22.29,9.03 22.17,8.91 22.17,7.43 24.12,5.49 24.12,2.63 25.15,1.6 JP-ICSP.4
  Bottom 0.254: v31.32,12 24.23,12 v23.55,11.32
N$32
  Top 0.254: Q7.1 65.15,32.46 65.04,32.35 65.04,31.09 R44.1 64.92,31.32 63.09,31.32 T3.3
N$35
  Top 0.254: T1.3 11.32,12.8 11.2,12.92 11.2,13.95 TR2.1 11.32,13.95 12.46,15.09 12.92,15.09 R40.1
N$36
  Top 0.254: R30.2 26.29,10.4 27.43,10.4 28.23,9.6 28.69,9.6 U1.4 28.8,9.49 29.26,9.49 32.12,6.63 32.12,2.17 JP-ICSP.1
N$37
  Top 0.254: U1.12 33.49,10.86 34.06,10.86 34.98,11.77 34.98,16.34 33.03,18.29 24.8,18.29 20,13.49 20,4.12 22.52,1.6 JP-ICSP.5
N$41  (via drill 0.41)
  Top 0.254: U1.1 28.69,13.37 26.29,13.37 D4.C 26.06,13.37 v24.46,13.37
  Bottom 0.254: v24.46,13.37 22.75,11.66 22.75,8.23 27.77,3.2 28.57,3.2 30.18,1.6 JP-ICSP.2
N$42  (via drill 0.41)
  Top 0.254: v34.86,18.29 37.95,21.37 37.95,22.86 37.6,23.2 37.6,23.32 37.03,23.89 R24.1 | v32.69,17.49 32.69,15.89 30.52,13.72 30.52,9.49 32.92,7.09 33.38,7.09 U1.9
  Bottom 0.254: v34.86,18.29 33.49,18.29 v32.69,17.49
N$46
  Top 0.254: Q5.1 36.46,27.09 36.46,25.72 R23.2 36.46,25.6 36.01,25.15 36.01,23.2 36.92,22.29 R24.2
N$51
  Top 0.254: R29.2 26.29,8.34 28.69,8.34 U1.5
N$52
  Top 0.254: R29.1 24.46,8.34 23.2,8.34 TIMER.A
PWRSENSOR-ON  (via drill 0.41)
  Top 0.254: v56.92,9.49 57.61,8.8 57.61,8.12 ATMEGA328P.22 | v37.03,16.46 35.55,16.46 v23.77,28.23 | v7.66,29.15 5.14,31.66 JP-PWRSENSOR.5
  Bottom 0.254: v56.92,9.49 53.84,9.49 46.86,16.46 v37.03,16.46 | v23.77,28.23 8.57,28.23 v7.66,29.15
RESET  (via drill 0.41)
  Top 0.254: D3.1 70.52,11.32 69.72,10.52 68.35,10.52 C7.1 68.24,10.52 68.01,10.74 65.72,10.74 RESET.2 | R1.2 72.58,10.52 71.44,10.52 70.64,11.32 D3.1 | v41.26,29.38 37.38,29.38 Q5.3 | v62.06,12.69 60.69,12.69 ATMEGA328P.29 | v70.64,12.8 70.64,11.43 D3.1
  Bottom 0.254: v41.26,29.38 66.86,29.38 67.89,30.4 78.3,30.4 79.9,28.8 79.9,11.54 | 79.9,11.54 79.9,2.97 78.3,1.37 74.3,1.37 73.72,1.94 ICSP.5 | 70.64,12.69 75.55,12.69 76.69,11.54 79.9,11.54 | 70.64,12.69 v62.06,12.69 | v70.64,12.8 70.64,12.69
RF-ON
  Top 0.254: R6.2 19.09,12.12 18.86,12.12 17.37,10.63 7.54,10.63 5.14,8.23 5.14,7.66 JP-COMM.3
RF_RX
  Top 0.254: ATMEGA328P.32 60.69,15.2 60.69,18.06 58.18,20.57 54.18,20.57 53.49,19.89 50.86,19.89 50.06,20.69 48.69,20.69 47.09,19.09 U$4.7 46.98,19.09 44.46,19.09 U$4.6
RF_RX_ON  (via drill 0.41)
  Top 0.254: v62.98,22.63 62.98,23.2 66.52,26.75 66.52,32.92 66.06,33.38 60.35,33.38 59.89,32.92 44.01,32.92 R16.2 | v59.32,21.26 v61.61,21.26 | v57.84,19.77 57.84,18.06 58.41,17.49 58.41,16.69 ATMEGA328P.2
  Bottom 0.254: v61.61,21.26 v62.98,22.63 | v57.84,19.77 v59.32,21.26
RF_TX  (via drill 0.41)
  Top 0.254: v59.89,17.72 59.21,17.03 59.21,16.69 ATMEGA328P.1
  Bottom 0.254: v59.89,17.72 60.92,17.72 62.18,18.97 JP-TX.1
RF_TX_ON  (via drill 0.41)
  Top 0.254: v61.95,13.83 64.12,16 R13.2 | v53.49,14.63 53.15,14.63 52.69,15.09 52.12,15.09 ATMEGA328P.9
  Bottom 0.254: v61.95,13.83 56.69,13.83 55.89,14.63 v53.49,14.63
RX  (via drill 0.41)
  Top 0.254: v58.98,14.63 60.01,13.6 60.58,13.6 ATMEGA328P.30 | v60.12,19.77 59.66,19.77 58.41,21.03 53.95,21.03 53.26,20.34 51.55,20.34 45.26,26.63 45.26,31.43 44.69,32 11.09,32 10.86,32.23 9.49,32.23 8.46,31.2 8.46,28.8 7.43,27.77 4.23,27.77 3.43,26.98 3.43,23.66 4.23,22.86 5.94,22.86 8.46,25.38 8.46,26.06 9.49,27.09 10.74,27.09 11.77,26.06 11.77,21.49 10.06,19.77 10.06,18.29 8.57,16.8 6.4,16.8 3.54,13.95 3.54,11.66 5.03,10.17 JP-COMM.4
  Bottom 0.254: v58.98,14.63 58.98,18.63 v60.12,19.77
SCL  (via drill 0.41)
  Top 0.254: v54.06,25.95 54.75,25.26 54.75,24.69 U$3.5 | v67.21,25.15 67.21,24.8 v69.38,22.63 | v65.72,17.37 65.04,16.69 65.04,14.52 62.41,11.89 60.69,11.89 ATMEGA328P.28 | v50.52,26.98 v46.52,30.98
  Bottom 0.254: v67.21,25.15 66.41,25.95 v54.06,25.95 53.95,25.95 52.92,26.98 v50.52,26.98 | v69.38,22.63 68.81,22.63 65.95,19.77 65.95,17.6 v65.72,17.37 | v46.52,30.98 45.26,32.23 9.49,32.23 6.51,29.26 5.14,29.26 JP-PWRSENSOR.4
SDA  (via drill 0.41)
  Top 0.254: U$3.6 55.44,24.57 55.44,24.12 55.09,23.77 53.95,23.77 53.15,22.97 53.15,22.63 SJ2.3 53.03,22.52 52.92,22.4 v52.92,21.14 | v51.21,17.49 49.61,15.89 43.2,15.89 42.63,15.32 42.63,14.63 43.09,14.17 43.89,14.17 44.12,13.95 44.12,13.72 v44.46,13.37 45.72,12.12 46.86,12.12 50.18,8.8 52.81,8.8 55.09,11.09 60.58,11.09 ATMEGA328P.27
  Bottom 0.254: v51.21,17.49 51.21,19.43 v52.92,21.14 | v44.46,13.37 38.98,13.37 35.66,16.69 16.92,16.69 15.32,18.29 15.32,19.77 14.4,20.69 12.57,20.69 6.63,26.63 5.14,26.63 JP-PWRSENSOR.3
SPI_MISO  (via drill 0.41)
  Top 0.254: v50.75,9.6 52.01,9.6 ATMEGA328P.16
  Bottom 0.254: v50.75,9.6 50.75,8.57 58.29,1.03 67.67,1.03 68.58,1.94 ICSP.1
SPI_MOSI  (via drill 0.41)
  Top 0.254: v59.44,11.89 59.09,11.54 54.86,11.54 53.72,10.4 52.12,10.4 ATMEGA328P.15
  Bottom 0.254: v59.44,11.89 73.72,11.89 76.81,8.8 78.3,8.8 79.1,8 79.1,4.57 78.18,3.66 74.52,3.66 74.18,3.31 72.47,3.31 71.21,4.57 ICSP.4
SPI_SCK
  Top 0.254: R20.1 52.58,7.09 53.49,8 ATMEGA328P.17 53.61,8.12 53.61,8.69 55.21,10.29 58.52,10.29 64.69,4.12 67.44,4.12 68.35,3.2 69.95,3.2 ICSP.3
TX  (via drill 0.41)
  Top 0.254: v66.06,25.15 68.58,22.63 68.58,18.17 67.78,17.37 66.86,17.37 66.06,18.17 66.06,19.77 65.27,20.57 64.35,20.57 63.32,19.55 63.32,16.34 61.38,14.4 60.69,14.4 ATMEGA328P.31 | v44.81,22.86 42.63,22.86 v41.15,24.35
  Bottom 0.254: v66.06,25.15 47.09,25.15 v44.81,22.86 | v41.15,24.35 13.49,24.35 10.06,27.77 4.23,27.77 3.43,26.98 3.43,19.77 5.26,17.95 5.26,12.92 5.14,12.8 JP-COMM.5
VBAT-ON  (via drill 0.41)
  Top 0.254: TR2.3 9.03,14.97 8.57,14.97 7.89,14.29 7.43,14.29 SJ1.1 6.86,13.72 v6.86,12.46 | v3.43,6.17 3.43,2.06 4.34,1.14 8.34,1.14 L5.1
  Bottom 0.254: v3.43,6.17 3.43,10.52 4.46,11.54 5.94,11.54 v6.86,12.46
VIN+  (via drill 0.41)
  Top 0.305: U$3.1 56.81,27.2 56.81,29.95 SJ3.2 56.81,30.06 56.81,30.63 56.12,31.32 52.46,31.32 51.89,30.75 49.95,30.75 R60.2 49.84,30.86 48.69,32 v47.66,32
  Bottom 0.305: v47.66,32 46.75,32.92 9.26,32.92 6.86,30.52 4.23,30.52 2.52,28.8 2.52,5.49 5.03,2.97 5.03,2.63 JP-COMM.1
VIN-  (via drill 0.41)
  Top 0.305: SJ1.2 7.43,15.77 8.34,15.77 8.46,15.89 11.09,15.89 TR2.2 11.2,16 12.12,16 12.92,16.8 R40.2 13.03,16.92 22.52,16.92 v26.29,20.69 | 65.04,28.46 65.04,28.12 65.15,28 Q7.3 | 65.04,28.46 65.04,29.38 R44.2 | 54.58,29.77 49.95,25.15 R60.1 | 54.58,29.77 54.75,29.95 55.32,29.95 SJ3.1 | v60.47,28.46 65.04,28.46 | 54.58,29.77 v55.89,28.46 56.08,28.27 U$3.2
  Bottom 0.305: v60.47,28.46 v55.89,28.46 49.15,28.46 41.38,20.69 v26.29,20.69
XTAL1  (via drill 0.41)
  Top 0.254: 39.49,14 38.18,12.69 38.18,12 U$2.OUT | 39.49,14 39.78,14.29 39.78,15.32 R3.2 | v43.43,14.97 49.38,14.97 50.98,16.57 53.49,16.57 ATMEGA328P.8 | 39.49,14 v39.32,14.17
  Bottom 0.254: v43.43,14.97 40.12,14.97 v39.32,14.17
XTAL2
  Top 0.254: U$2.IN 43.09,12 43.09,12.69 41.49,14.29 41.49,15.32 R3.1 41.6,15.43 42.52,16.34 48.92,16.34 50.86,18.29 53.26,18.29 54.29,17.26 54.29,16.69 ATMEGA328P.7

### Text on the board
_bsilk: IN1 | PWR-ON | IN2 | SCL | IN3 | SDA | IN4 | GND | PWR SENSOR | GND | +3V3 | GND | DRIVER | DC+ | ADC1 | TX | +3V3 | RX | ADC2 | RF-ON | ENCODER | GND | GND | PWR/COMM | VIN+ | ADC3